# Altium schematic sheet DC_DC Power Supply.SchDoc
size A; SheetNumber: 1; SheetTotal: 3
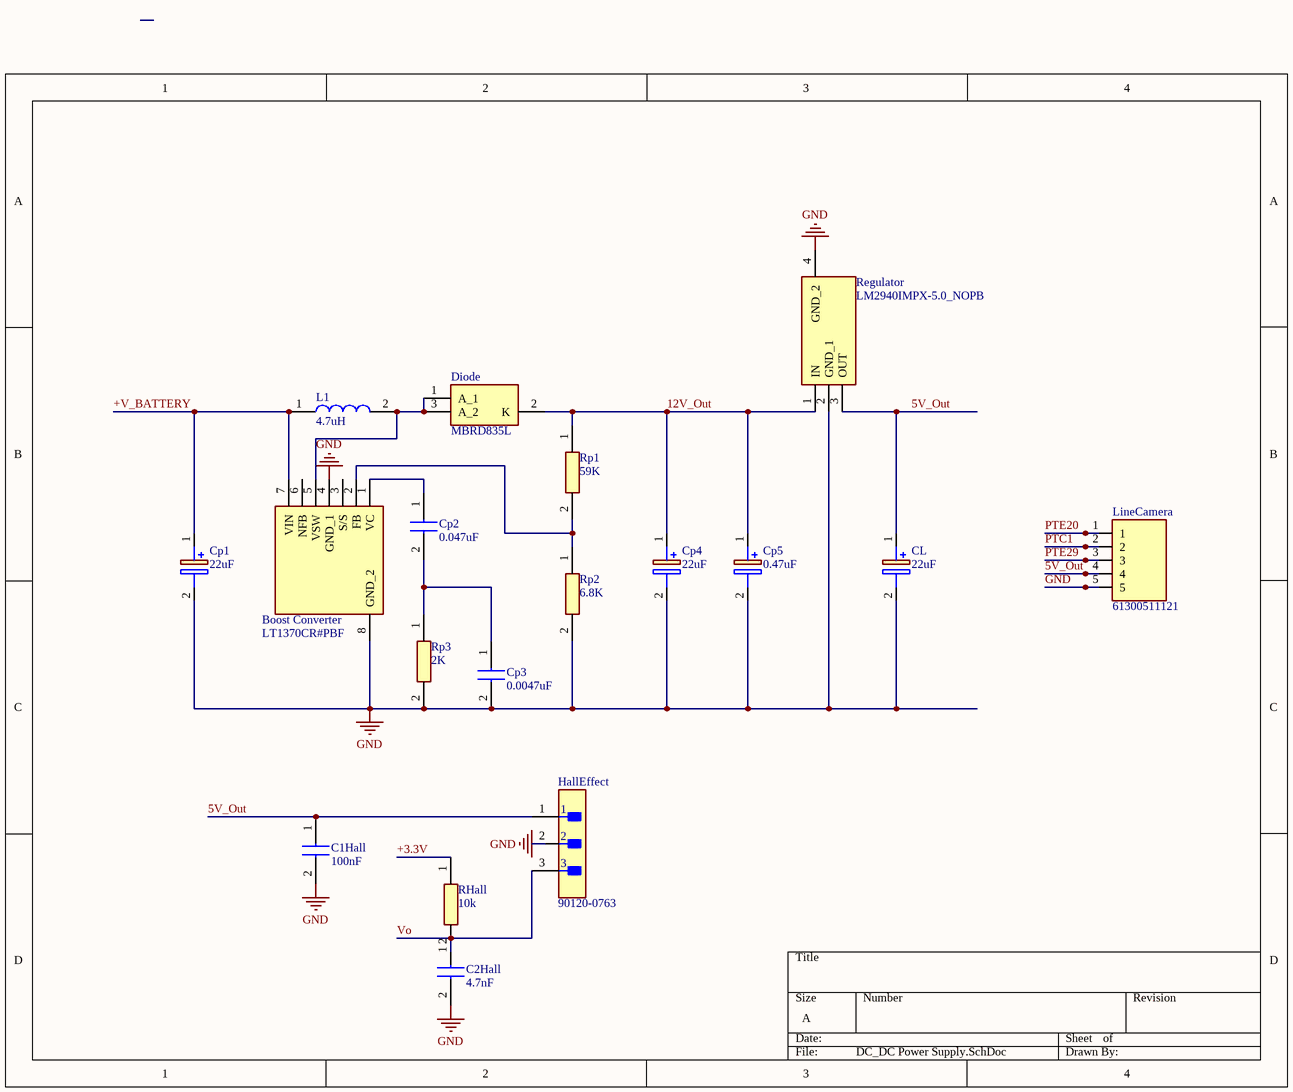
[diagram p0: DC_DC Power Supply.SchDoc]

## Parts
Boost_Converter  LT1370CR#PBF  [LT1370CRPBF]
C1Hall  100nF  [CAPC5750X450N]
C2Hall  4.7nF  [C1812]
CL  22uF  [CAPAE430X550N]
Cp1  22uF  [CAPAE430X550N]
Cp2  0.047uF  [CAPC0603X33N]
Cp3  0.0047uF  [CAPC0603X33N]
Cp4  22uF  [CAPAE430X550N]
Cp5  0.47uF  [CAPAE430X550N]
Diode  MBRD835L  [MBRD835L]
HallEffect  90120-0763  [FP-90120-0763-MFG]
L1  4.7uH  [ETQ-P4M_KFM]
LineCamera  61300511121  [HDRV5W64P0X254_1X5_1270X254X854P]
Regulator  LM2940IMPX-5.0_NOPB  [SOT230P700X180-4N]
RHall  10k  [RESC1005X40N]
Rp1  59K  [ERJ2RKD1004X]
Rp2  6.8K  [RESC1608X55N]
Rp3  2K  [ERJ2RKD1004X]

## Nets
GND: Boost_Converter.4(GND_1) Boost_Converter.8(GND_2) C1Hall.2 C2Hall.2 CL.2(-) Cp1.2(-) Cp3.2 Cp4.2(-) Cp5.2(-) HallEffect.2 LineCamera.5 Regulator.2(GND_1) Regulator.4(GND_2) Rp2.2 Rp3.2
5V_Out: C1Hall.1 CL.1(+) HallEffect.1 LineCamera.4 Regulator.3(OUT)
12V_Out: Cp4.1(+) Cp5.1(+) Diode.2(K) Regulator.1(IN) Rp1.1
+3.3V: RHall.1
+V_BATTERY: Boost_Converter.7(VIN) Cp1.1(+) L1.1
PTC1: LineCamera.2
PTE20: LineCamera.1
PTE29: LineCamera.3
Vo: C2Hall.1 HallEffect.3 RHall.2
NetBoost_Converter_1: Boost_Converter.1(VC) Cp2.1
NetBoost_Converter_2: Boost_Converter.2(FB) Rp1.2 Rp2.1
NetBoost_Converter_5: Boost_Converter.5(VSW) Diode.1(A_1) Diode.3(A_2) L1.2
NetCp2_2: Cp2.2 Cp3.1 Rp3.1

Not connected (* = marked no-connect by the designer): Boost_Converter 3(S/S) 6(NFB)

## Library data of the parts
Boost_Converter = LT1370CR#PBF: 12V Boost Converter; Manufacturer_Name: Analog Devices; Datasheet Link: https://www.analog.com/media/en/technical-documentation/data-sheets/1370fs.pdf; Height: 4.877mm; Manufacturer_Part_Number: LT1370CR#PBF; Mouser Part Number: 584-LT1370CR#PBF; Mouser Price/Stock: https://www.mouser.co.uk/ProductDetail/Analog-Devices/LT1370CRPBF?qs=ytflclh7QUVSQHKAEhLuUA%3D%3D; Arrow Part Number: LT1370CR#PBF; Arrow Price/Stock: https://www.arrow.com/en/products/lt1370crpbf/analog-devices?utm_currency=USD&region=nac
C1Hall = 2220Y2K00104KXRWS3: Capacitor; Manufacturer_Name: Knowles; Datasheet Link: https://www.knowlescapacitors.com/getattachment/e7984308-bd6c-4e1d-824e-8ae6037a2b25/StackiCap; Height: 4.5mm; Manufacturer_Part_Number: 2220Y2K00104KXRWS3; Mouser Part Number: 843-2220Y2K104KXRWS2; Mouser Price/Stock: https://www.mouser.co.uk/ProductDetail/Knowles-Syfer/2220Y2K00104KXRWS3?qs=7MVldsJ5UaxGI75VDyrs7w%3D%3D
C2Hall = C1812C472KGRACAUTO: Capacitor; Manufacturer_Name: KEMET; Datasheet Link: https://content.kemet.com/datasheets/KEM_C1076_X7R_HV_AUTO_SMD.pdf; Height: 1.55mm; Manufacturer_Part_Number: C1812C472KGRACAUTO; Mouser Part Number: 80-C1812C472KGRAUTO; Mouser Price/Stock: https://www.mouser.co.uk/ProductDetail/KEMET/C1812C472KGRACAUTO?qs=f9yNj16SXrLK%252BHmDDKifeA%3D%3D; Arrow Part Number: C1812C472KGRACAUTO; Arrow Price/Stock: https://www.arrow.com/en/products/c1812c472kgracauto/kemet-corporation
CL Cp1 Cp4 = UWP1HR22MCL1GB: Capacitor Polarised; Manufacturer_Name: Nichicon; Datasheet Link: https://www.nichicon.co.jp/english/series_items/catalog_pdf/e-uwp.pdf; Height: 5.5mm; Manufacturer_Part_Number: UWP1HR22MCL1GB; Mouser Part Number: 647-UWP1HR22MCL; Mouser Price/Stock: https://www.mouser.co.uk/ProductDetail/Nichicon/UWP1HR22MCL1GB?qs=3GbUB62Nf7dRFOPfOwO6sg%3D%3D
  Cp1: Supplier 1: Digikey; Supplier Part Number 1: 493-9831-1-ND
Cp2 = GRM033R61C473KE84D: Capacitor; Manufacturer_Name: Murata Electronics; Datasheet Link: https://search.murata.co.jp/Ceramy/image/img/A01X/G101/ENG/GRM033R61C473KE84-01A.pdf; Height: 0.33mm; Manufacturer_Part_Number: GRM033R61C473KE84D; Mouser Part Number: 81-GRM033R61C473KE4D; Mouser Price/Stock: https://www.mouser.co.uk/ProductDetail/Murata-Electronics/GRM033R61C473KE84D?qs=vCoBJ5OiJk4E%252B%2Fgs75qrtQ%3D%3D; Arrow Part Number: GRM033R61C473KE84D; Arrow Price/Stock: https://www.arrow.com/en/products/grm033r61c473ke84d/murata-manufacturing
Cp3 = GRM033R71A472KA01D: Capacitor; Manufacturer_Name: Murata Electronics; Datasheet Link: https://search.murata.co.jp/Ceramy/image/img/A01X/G101/ENG/GRM033R71A472KA01-01A.pdf; Height: 0.33mm; Manufacturer_Part_Number: GRM033R71A472KA01D; Mouser Part Number: 81-GRM033R71A472KA1D; Mouser Price/Stock: https://www.mouser.co.uk/ProductDetail/Murata-Electronics/GRM033R71A472KA01D?qs=7RtWncwVCuzI4WvsbOl%2FQA%3D%3D; Arrow Part Number: GRM033R71A472KA01D; Arrow Price/Stock: https://www.arrow.com/en/products/grm033r71a472ka01d/murata-manufacturing
Cp5 = 865230640004: Capacitor Polarised; Manufacturer_Name: Wurth Elektronik; Datasheet Link: https://componentsearchengine.com/Datasheets/1/865230640004.pdf; Height: 5.5mm; Manufacturer_Part_Number: 865230640004; Mouser Part Number: 710-865230640004; Mouser Price/Stock: https://www.mouser.co.uk/ProductDetail/Wurth-Elektronik/865230640004?qs=0KOYDY2FL2%2FYTqRiFtrQpw%3D%3D
Diode = MBRD835L: Diode; Manufacturer_Name: onsemi; Datasheet Link: https://www.onsemi.com/pdf/datasheet/mbrd835l-d.pdf; Height: 2.38mm; Manufacturer_Part_Number: MBRD835L; Mouser Part Number: 863-MBRD835L; Mouser Price/Stock: https://www.mouser.co.uk/ProductDetail/onsemi/MBRD835L?qs=3JMERSakebplE9MTkRawVw%3D%3D
HallEffect = CMP-04776-000084-1: CONN HEADER VERT 3POS 2.54MM; Manufacturer: Molex; Voltage Rating: 350V; Number Of Contacts: 3; Conn Orientation: Vertical; Current Rating: 3A; Conn Gender: Male; Package: 90120-0763; ComponentLink2Description: Datasheet; Height: 5.8mm; Manufacturer Part Number: 90120-0763; Temperature Range High: +125°C; RoHS: TRUE; ComponentLink2URL: https://www.molex.com/webdocs/datasheets/pdf/en-us/0901200763_PCB_HEADERS.pdf; Device Class L2: Headers and Wire Housings; Temperature: -55°C to +125°C; Device Class L1: Connectors; Pitch: 2.54mm; Footprint Url: https://www.molex.com/pdm_docs/sd/901200763_sd.pdf; Device Class L3: unset; Temperature Range Low: -55°C; Number Of Rows: 1; Category: Conn; Lead Free: Yes; Mouser Description: Board-To-Board Connector, C-Grid III 90120 Series, Through Hole, Header, 3, 2.54 mm; Octopart: https://octopart.com/90120-0763-molex-655433; Contact Material: Gold,Nickel; Automotive: No; Digikey Description: CONN HEADER VERT 3POS 2.54MM
L1 = ETQ-P4M4R7KFM: Inductor; Manufacturer_Name: Panasonic; Datasheet Link: http://industrial.panasonic.com/cdbs/www-data/pdf/AGL0000/AGL0000C73.pdf; Height: 4.8mm; Manufacturer_Part_Number: ETQ-P4M4R7KFM; Mouser Part Number: 667-ETQ-P4M4R7KFM; Mouser Price/Stock: https://www.mouser.co.uk/ProductDetail/Panasonic/ETQ-P4M4R7KFM?qs=PqoDHHvF649m773nMECVZA%3D%3D
LineCamera = 61300511121: Connector; Manufacturer_Name: Wurth Elektronik; Datasheet Link: http://katalog.we-online.de/em/datasheet/6130xx11121.pdf; Height: 8.54mm; Manufacturer_Part_Number: 61300511121; Mouser Part Number: 710-61300511121; Mouser Price/Stock: https://www.mouser.co.uk/ProductDetail/Wurth-Elektronik/61300511121?qs=PhR8RmCirEZCsCRHq%252BvfRQ%3D%3D
Regulator = LM2940IMPX-5.0_NOPB: Integrated Circuit; Manufacturer_Name: Texas Instruments; Manufacturer_Part_Number: LM2940IMPX-5.0/NOPB; Datasheet Link: http://www.ti.com/lit/gpn/lm2940-n; Height: 1.8mm; Mouser Part Number: 926-LM2940IMPX50NOPB; Mouser Price/Stock: https://www.mouser.co.uk/ProductDetail/Texas-Instruments/LM2940IMPX-5.0-NOPB?qs=X1J7HmVL2ZELzMHXu8bpyQ%3D%3D; Arrow Part Number: LM2940IMPX-5.0/NOPB; Arrow Price/Stock: https://www.arrow.com/en/products/lm2940impx-5.0nopb/texas-instruments?region=nac
RHall = RC0402JR-0710KL: Resistor; Manufacturer_Name: KEMET; Datasheet Link: http://www.yageo.com/documents/recent/PYu-RC0402_51_RoHS_L_6_r.pdf; Height: 0.4mm; Manufacturer_Part_Number: RC0402JR-0710KL; Mouser Part Number: 603-RC0402JR-0710KL; Mouser Price/Stock: https://www.mouser.co.uk/ProductDetail/YAGEO/RC0402JR-0710KL?qs=V1yeUXFNrkk4BhFptVo0Rw%3D%3D
Rp1 = ERJ-2RKF5902X: Resistor; Manufacturer_Name: Panasonic; Datasheet Link: https://industrial.panasonic.com/cdbs/www-data/pdf/RDA0000/AOA0000C86.pdf; Height: 0.4mm; Manufacturer_Part_Number: ERJ-2RKF5902X; Mouser Part Number: 667-ERJ-2RKF5902X; Mouser Price/Stock: https://www.mouser.co.uk/ProductDetail/Panasonic/ERJ-2RKF5902X?qs=YMBIwoNQYdVdwi4zXGse%252Bw%3D%3D; Arrow Part Number: ERJ-2RKF5902X; Arrow Price/Stock: https://www.arrow.com/en/products/erj-2rkf5902x/panasonic?region=nac
Rp2 = RC0603FR-106K8L: Resistor; Manufacturer_Name: KEMET; Datasheet Link: http://www.yageo.com/documents/recent/PYu-RC0603_51_RoHS_L_v5.pdf; Height: 0.55mm; Manufacturer_Part_Number: RC0603FR-106K8L; Mouser Part Number: 603-RC0603FR-106K8L; Mouser Price/Stock: https://www.mouser.co.uk/ProductDetail/YAGEO/RC0603FR-106K8L?qs=Iqe6t0HYRD4RKBucIg6YEg%3D%3D
Rp3 = ERJ-2RKF2001X: Resistor; Manufacturer_Name: Panasonic; Datasheet Link: https://industrial.panasonic.com/cdbs/www-data/pdf/RDA0000/AOA0000C86.pdf; Height: 0.4mm; Manufacturer_Part_Number: ERJ-2RKF2001X; Mouser Part Number: 667-ERJ-2RKF2001X; Mouser Price/Stock: https://www.mouser.co.uk/ProductDetail/Panasonic/ERJ-2RKF2001X?qs=H7k1u0Mp9JSbtBe1nkwQGA%3D%3D; Arrow Part Number: ERJ-2RKF2001X; Arrow Price/Stock: https://www.arrow.com/en/products/erj-2rkf2001x/panasonic?region=europe